# EAGLE design adapter (EAGLE 8.7.1)
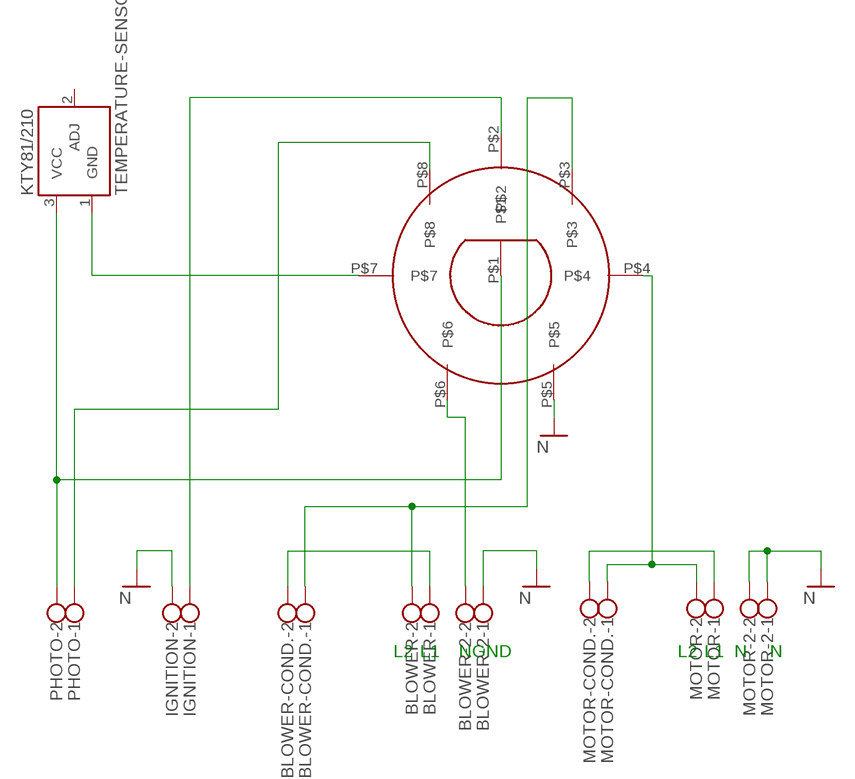
[diagram p0: schematic, sheet 1]

## Parts
BLOWER  W237-102  [W237-102]
BLOWER-2  W237-102  [W237-102]
BLOWER-COND.  W237-102  [W237-102]
IGNITION  W237-102  [W237-102]
KTY81/210  TEMPERATURE-SENSOR  [TO-92]
MOTOR  W237-102  [W237-102]
MOTOR-2  W237-102  [W237-102]
MOTOR-COND.  W237-102  [W237-102]
PHOTO  W237-102  [W237-102]
U$1  PX0959/P  [PX0959/P]

## Nets
GND: BLOWER-2.1 IGNITION.2 MOTOR-2.1 MOTOR-2.2 U$1.P$5 ; supply symbol labelled N
N$1: PHOTO.1 U$1.P$8
N$2: IGNITION.1 U$1.P$2
N$3: KTY81/210.3(VCC) PHOTO.2 U$1.P$1
N$4: KTY81/210.1(GND) U$1.P$7
N$5: MOTOR-COND..2 MOTOR.1
N$7: BLOWER-COND..1 BLOWER.2 U$1.P$3
N$8: BLOWER-2.2 U$1.P$6
N$9: BLOWER-COND..2 BLOWER.1
N$10: MOTOR-COND..1 MOTOR.2 U$1.P$4
Unconnected: KTY81/210.2(ADJ)

## Notes on the sheet
- L2 | L1 | N | GND | L2 | L1 | N | N

## Library data of the parts
BLOWER BLOWER-2 BLOWER-COND. IGNITION MOTOR MOTOR-2 MOTOR-COND. PHOTO = con-wago-500:W237-102: WAGO SCREW CLAMP; MPN: 237-102; OC_FARNELL: unknown; OC_NEWARK: 70K9898
KTY81/210 = SparkFun-Sensors:TEMPERATURE-SENSOR: TO-92 temp sensor
U$1 = PX0959:P:PX0959/P

## Board
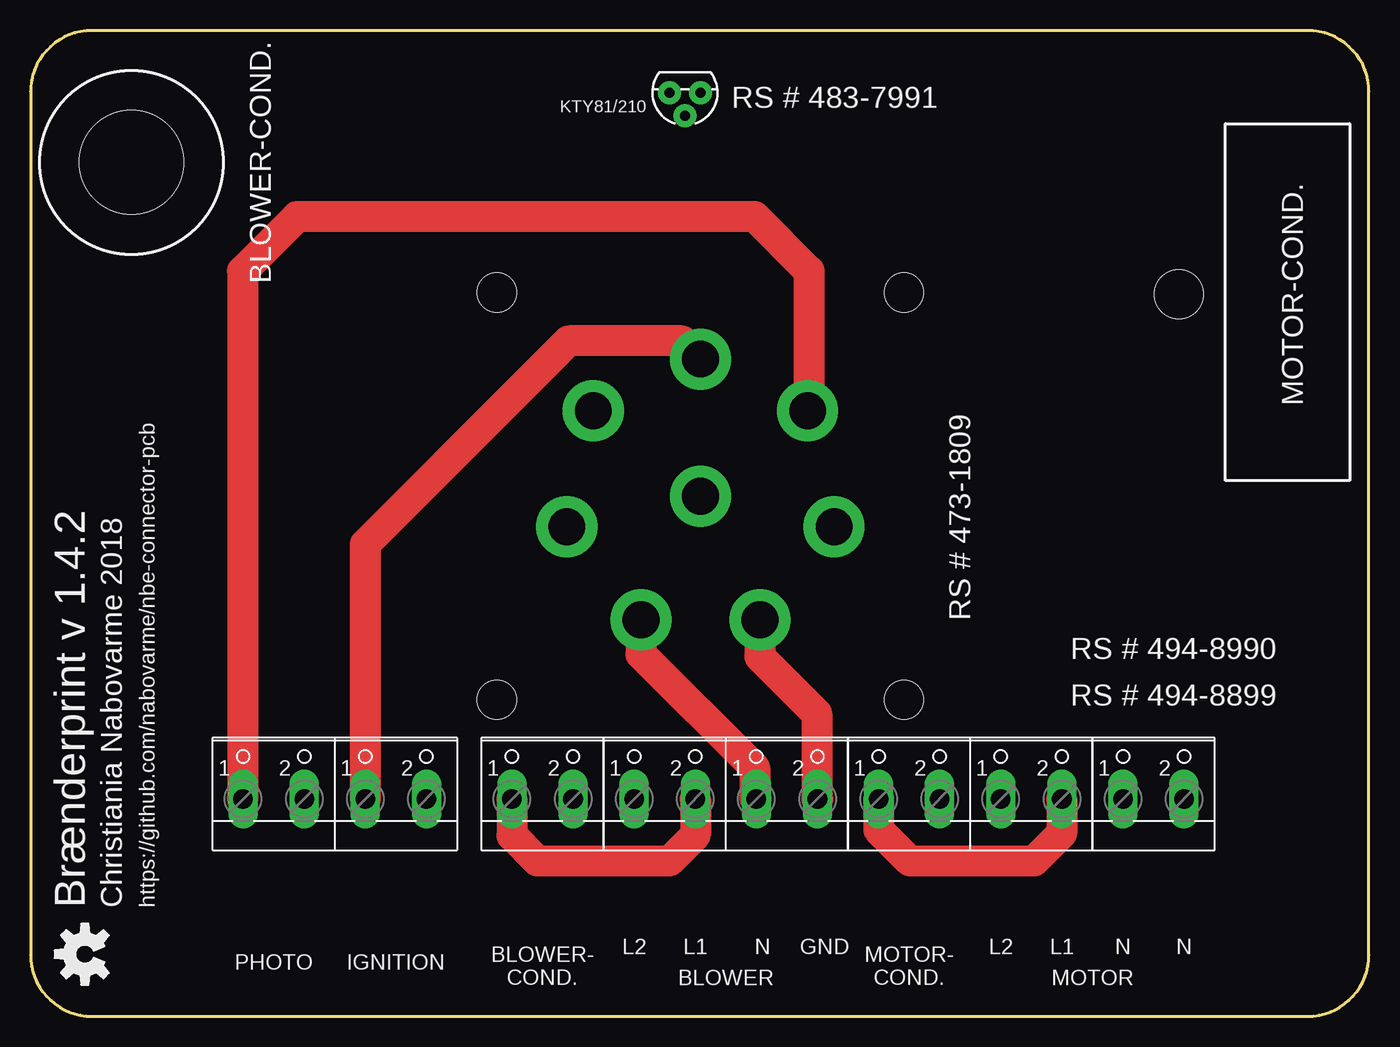
[diagram p1: board, top side]
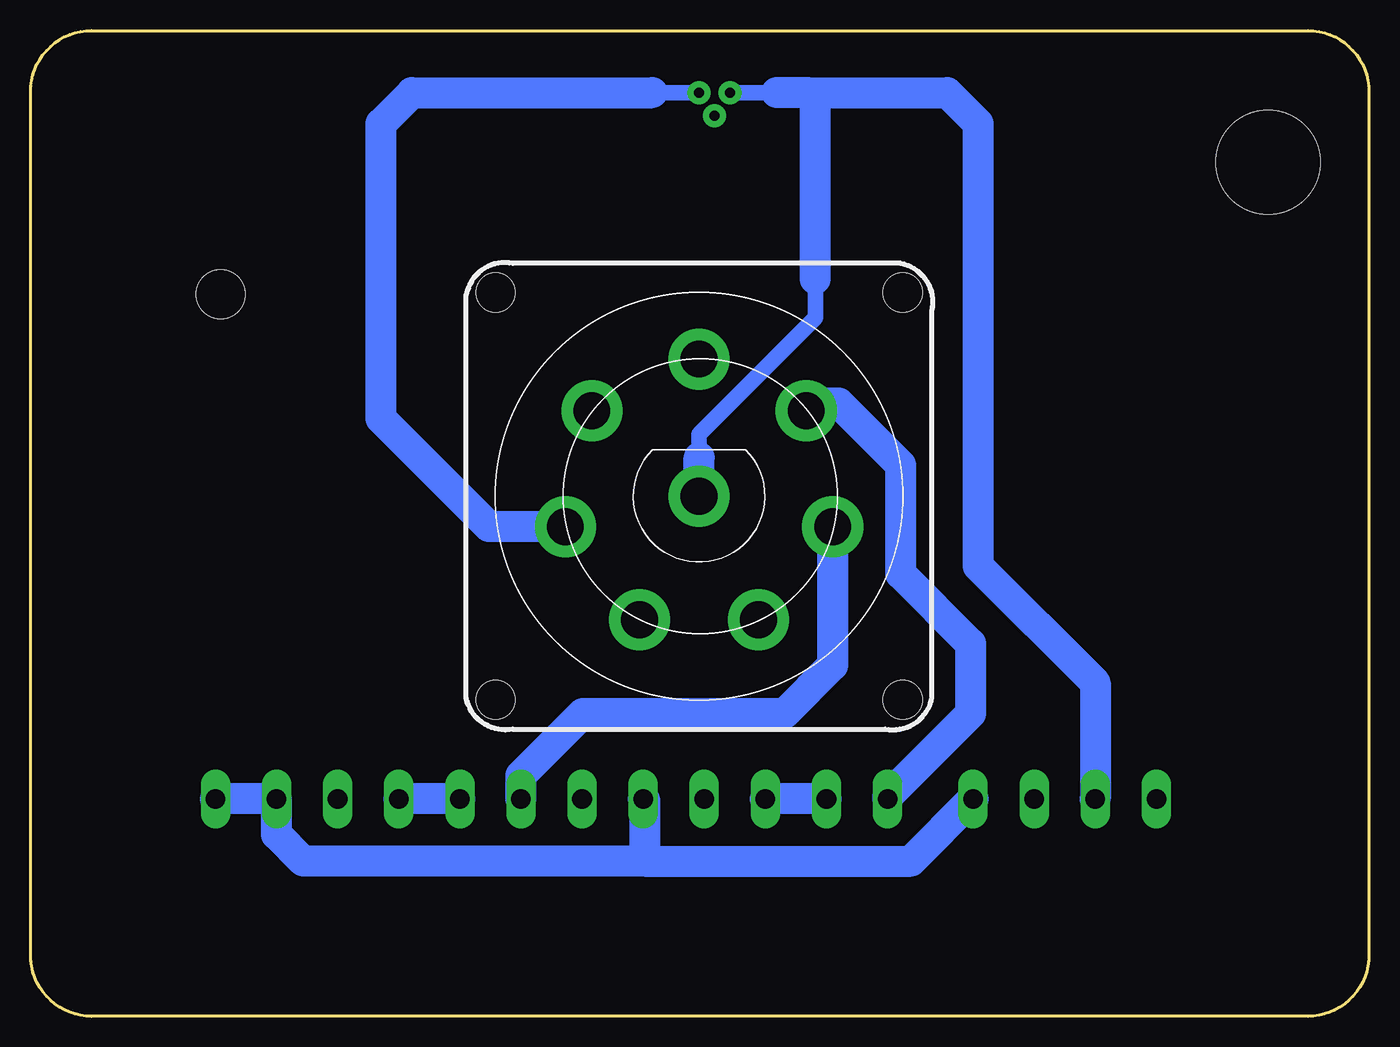
[diagram p2: board, bottom side, seen from below]

Size 109.53 x 80.64 mm. Coordinates in mm from the lower left corner, seen from the top.
Outline: 5,0 104.53,0 arc90 109.53,5 109.53,75.64 arc90 104.53,80.64 5,80.64 arc90 0,75.64 0,5 arc90 5,0
Copper layers (1*16): Top 0.035mm / dielectric 1.5mm / Bottom 0.035mm
Design rules "default *": minimum track width 100mil, minimum drill 24mil, track to track 8mil, track to pad 8mil, pad to pad 8mil, via to via 8mil, smd to smd 8mil, copper to edge 40mil, drill to drill 8mil, minimum pad ring 10mil, minimum via ring 8mil, stop-mask expansion 4mil, vias tented up to drill 0mil, thermal gap 10mil
Holes 4 mm at 93.98,59.05
Holes 8.5 mm at 8.26,69.85

### Footprints (pad centres in the part's own frame; a part is rotated, then mirrored left to right if it is on the bottom)
W237-102 = drill 1.6 long: 1 -2.5,-1.27; 2 2.5,-1.27
TO-92 = drill 0.813 pad 1.88: 1 -1.27,0; 2 0,1.905; 3 1.27,0
PX0959/P = drill 3 pad 5: P$1 0,0; P$2 0,11.215; P$3 8.768,6.992; P$4 10.934,-2.496; P$5 4.866,-10.104; P$6 -4.866,-10.104; P$7 -10.934,-2.496; P$8 -8.768,6.992 | hole 3.2: -16.65,16.65; 16.65,16.65; 16.65,-16.65; -16.65,-16.65

### Placement (x,y rotation side)
BLOWER  51.89,19.05 0 top
BLOWER-2  61.89,19.05 0 top
BLOWER-COND.  41.89,19.05 0 top
IGNITION  29.89,19.05 0 top
KTY81/210  53.55,75.57 180 top
MOTOR  81.9,19.05 0 top
MOTOR-2  91.9,19.05 0 top
MOTOR-COND.  71.9,19.05 0 top
PHOTO  19.89,19.05 0 top
U$1  54.82,42.54 0 bottom
U$2  [OSHW-LOGO-M]  4.45,5.08 90 top

### Tracks (layer width: path | path; a pad name or v marks a point on that pad's centre or on a via)
GND
  Top 2.54: U$1.P$5 49.95,29.63 59.26,20.32 59.26,17.91 BLOWER-2.1
  Bottom 2.54: IGNITION.2 37.47,12.7 59.26,12.7 | 59.26,12.7 87.2,12.7 89.4,14.89 MOTOR-2.1 MOTOR-2.2 | BLOWER-2.1 59.26,17.65 59.26,12.7
N$1
  Top 2.54: U$1.P$8 63.71,49.66 63.71,60.96 59.26,65.41 21.8,65.41 17.36,60.96 17.36,17.82 PHOTO.1
N$2
  Top 2.54: U$1.P$2 53.33,55.24 44.02,55.24 27.39,38.61 IGNITION.1
N$3
  Bottom 1.27: 48.47,75.57 KTY81/210.3 | 54.82,45.72 54.82,47.62 45.29,57.15 45.29,60.32
  Bottom 2.54: 45.93,75.57 34.5,75.57 31.96,73.03 31.96,36.83 22.39,27.27 PHOTO.2 | 45.93,75.57 48.47,75.57 | U$1.P$1 54.82,45.72 | 45.29,60.32 45.29,74.93 45.93,75.57
N$4
  Bottom 1.27: 58.63,75.57 KTY81/210.1
  Bottom 2.54: U$1.P$7 72.01,40.05 80.86,48.89 80.86,73.03 78.31,75.57 58.63,75.57
N$5
  Bottom 2.54: MOTOR-COND..2 MOTOR.1
N$7
  Top 2.54: BLOWER-COND..1 39.39,14.79 41.48,12.7 52.28,12.7 54.39,14.81 BLOWER.2
  Bottom 2.54: U$1.P$3 45.42,50.16 43.39,50.16 38.31,45.09 38.31,36.2 32.59,30.48 32.59,24.77 39.39,17.96 BLOWER-COND..1
N$8
  Top 2.54: U$1.P$6 59.69,29.42 64.34,24.77 64.34,17.83 BLOWER-2.2
N$9
  Bottom 2.54: BLOWER-COND..2 BLOWER.1
N$10
  Top 2.54: MOTOR-COND..1 69.4,15.27 71.97,12.7 82.12,12.7 84.4,14.97 MOTOR.2
  Bottom 2.54: U$1.P$4 43.89,28.71 47.83,24.77 64.34,24.77 69.42,19.69 69.42,17.81 MOTOR-COND..1

### Text on the board
tNames: RS # 483-7991 | BLOWER-COND. | MOTOR-COND. | RS # 473-1809 | RS # 494-8990 | RS # 494-8899 | Brænderprint v 1.4.2 | Christiania Nabovarme 2018 | https://github.com/nabovarme/nbe-connector-pcb | L2 | L1 | N | GND | L2 | L1 | N | N | PHOTO | IGNITION | BLOWER- / COND. | BLOWER | MOTOR- / COND. | MOTOR